# EAGLE design RemoteControl (EAGLE 9.5.0)
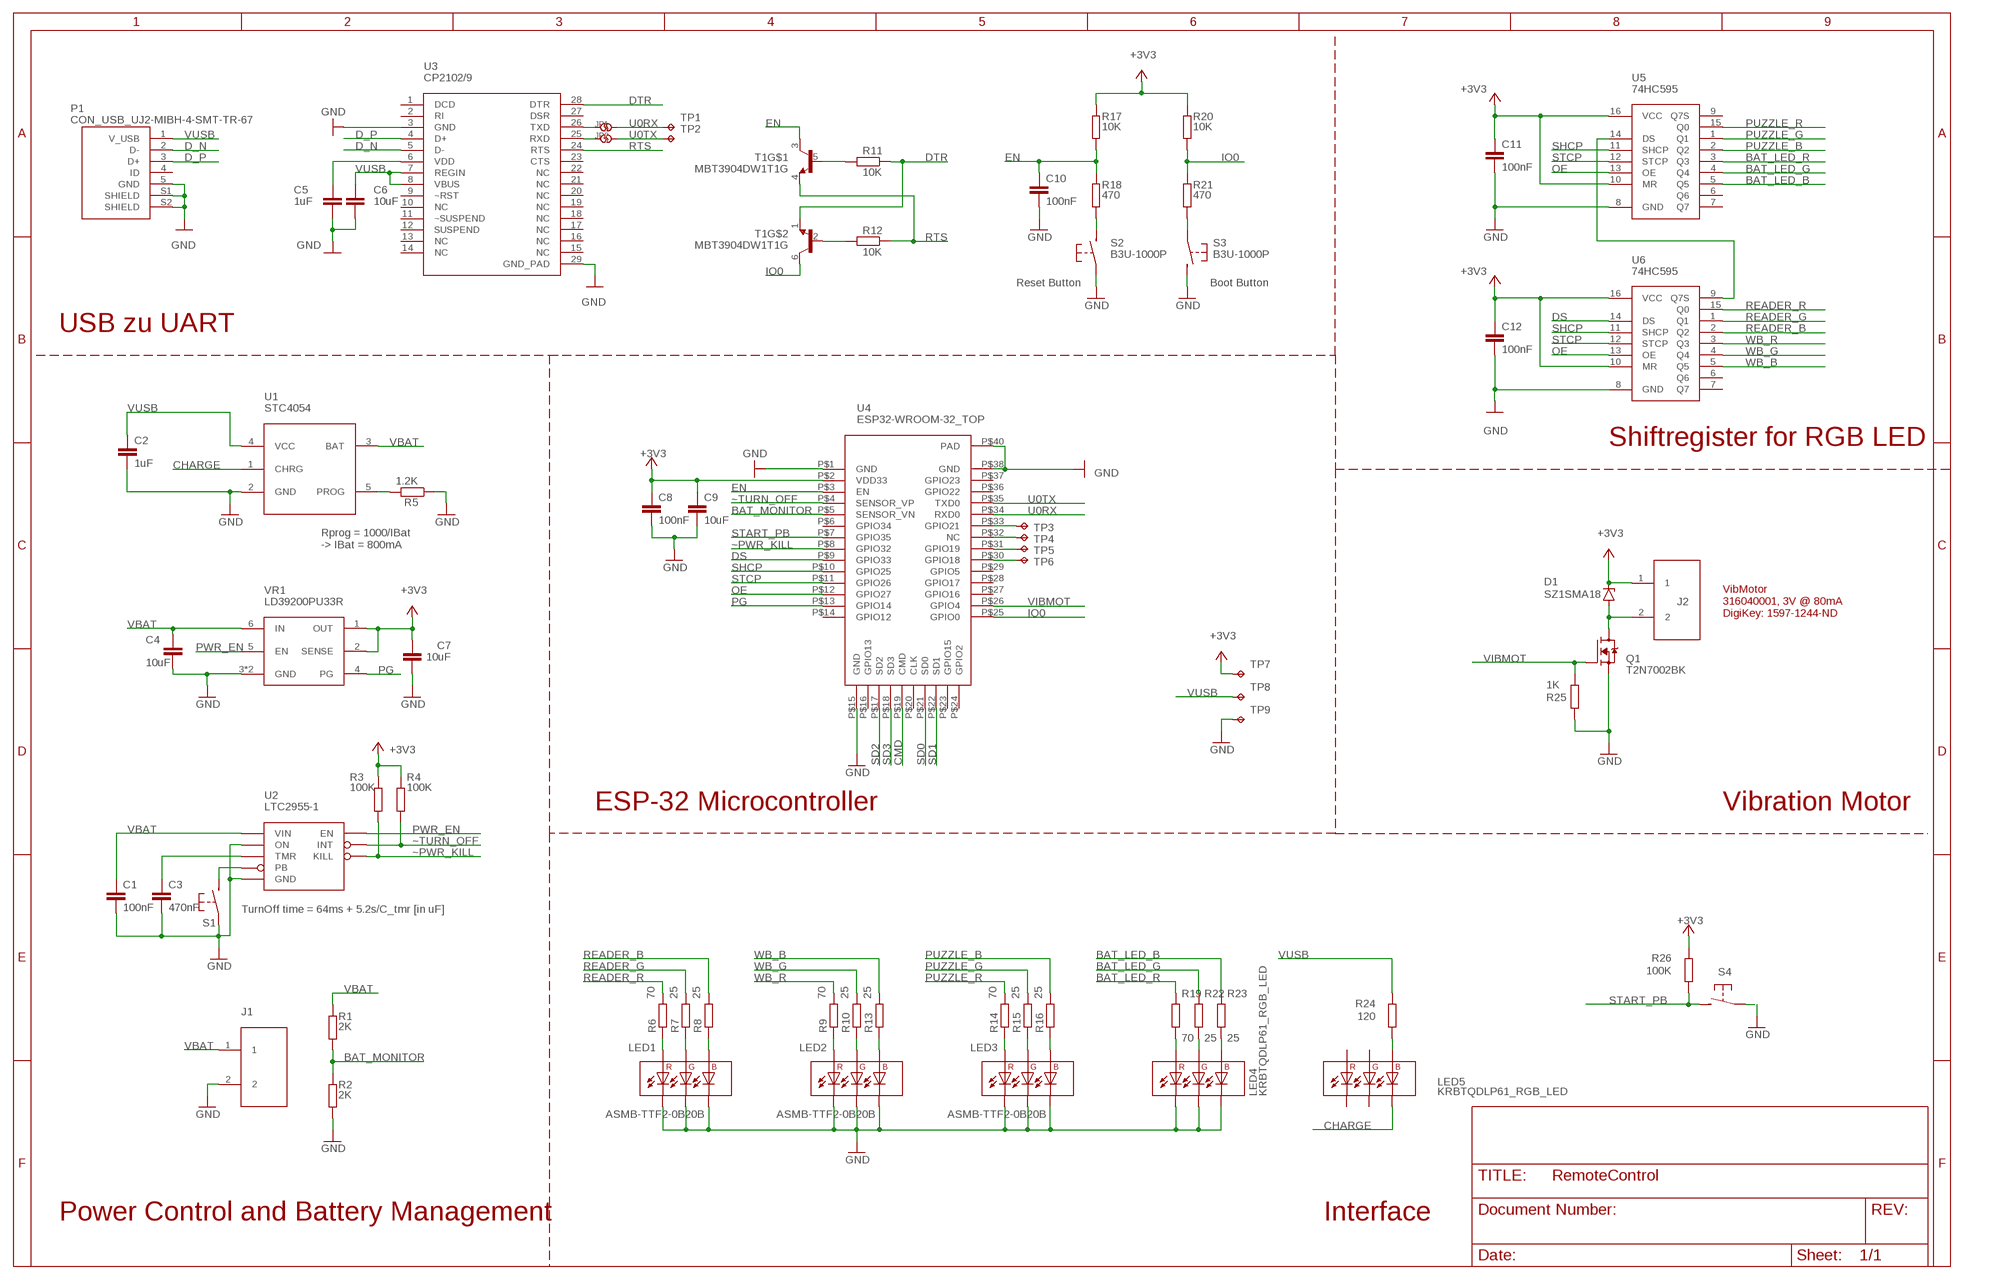
[diagram p0: schematic, sheet 1]

## Parts
C1  100nF  CAP_0603  [0603]
C2  1uF  CAP_0603  [0603]
C3  470nF  CAP_0603  [0603]
C4  10uF  CAP_0603  [0603]
C5  1uF  CAP_0603  [0603]
C6  10uF  CAP_0603  [0603]
C7  10uF  CAP_0603  [0603]
C8  100nF  CAP_0603  [0603]
C9  10uF  CAP_0603  [0603]
C10  100nF  CAP_0603  [0603]
C11  100nF  CAP_0603  [0603]
C12  100nF  CAP_0603  [0603]
D1  SZ1SMA18  SZ1SMA18AT3G_Z_DIODE  [SMA-2]
J1  CON_2  [CON_2]
J2  CON_2  [CON_2]
JP1  SOLDER_JUMPER  [SOLDER_JUMPER]
JP2  SOLDER_JUMPER  [SOLDER_JUMPER]
LED1  ASMB-TTF2-0B20B  ASMB-TTF2-0B20B_RGB_LED  [ASMB-TTF2-0B20B_RGB_LED]
LED2  ASMB-TTF2-0B20B  ASMB-TTF2-0B20B_RGB_LED  [ASMB-TTF2-0B20B_RGB_LED]
LED3  ASMB-TTF2-0B20B  ASMB-TTF2-0B20B_RGB_LED  [ASMB-TTF2-0B20B_RGB_LED]
LED4  KRBTQDLP61_RGB_LED  [KRBTQDLP61_RGB_LED]
LED5  KRBTQDLP61_RGB_LED  [KRBTQDLP61_RGB_LED]
P1  CON_USB_UJ2-MIBH-4-SMT-TR-67  [CON_USB_UJ2-MIBH-4-SMT-TR-67]
Q1  T2N7002BK  [SOT23-3]
R1  2K  RES_0603  [0603]
R2  2K  RES_0603  [0603]
R3  100K  RES_0603  [0603]
R4  100K  RES_0603  [0603]
R5  1.2K  RES_0603  [0603]
R6  70  RES_0603  [0603]
R7  25  RES_0603  [0603]
R8  25  RES_0603  [0603]
R9  70  RES_0603  [0603]
R10  25  RES_0603  [0603]
R11  10K  RES_0603  [0603]
R12  10K  RES_0603  [0603]
R13  25  RES_0603  [0603]
R14  70  RES_0603  [0603]
R15  25  RES_0603  [0603]
R16  25  RES_0603  [0603]
R17  10K  RES_0603  [0603]
R18  470  RES_0603  [0603]
R19  70  RES_0603  [0603]
R20  10K  RES_0603  [0603]
R21  470  RES_0603  [0603]
R22  25  RES_0603  [0603]
R23  25  RES_0603  [0603]
R24  120  RES_0603  [0603]
R25  1K  RES_0603  [0603]
R26  100K  RES_0603  [0603]
S1  EG5358CT-ND_PB  [EG5358CT-ND_PB]
S2  B3U-1000P  BUTTON_B3U-1000P  [B3U-1000P]
S3  B3U-1000P  BUTTON_B3U-1000P  [B3U-1000P]
S4  TL3313AF160QG_2  BUTTON_TL3313AF160QG_2  [TL3313AF160QG_2]
T1  MBT3904DW1T1G  [SOT23-6]
TP1  TP  [TEST_PAD]
TP2  TP  [TEST_PAD]
TP3  TP  [TEST_PAD]
TP4  TP  [TEST_PAD]
TP5  TP  [TEST_PAD]
TP6  TP  [TEST_PAD]
TP7  TP  [TEST_PAD]
TP8  TP  [TEST_PAD]
TP9  TP  [TEST_PAD]
U1  STC4054  STC4054_BAT_CHARGER  [TSOT23-5L]
U2  LTC2955-1  LTC2955-1_ON/OFF_CTLR  [SOT23-8]
U3  CP2102/9  [QFN-28]
U4  ESP32-WROOM-32_TOP  [ESP32-WROOM-32_TOP]
U5  74HC595  74HC595_SHIFTREGISTER  [SOIC-16]
U6  74HC595  74HC595_SHIFTREGISTER  [SOIC-16]
VR1  LD39200PU33R  LD39200PU33R_V-REG  [DFN-6]

## Nets
+3V3: C7.2 C8.1 C9.1 C11.1 C12.1 D1.1(C) J2.1 R3.1 R4.1 R17.2 R20.2 R26.2 TP7.TP U4.P$2(VDD33) U5.10(MR) U5.16(VCC) U6.10(MR) U6.16(VCC) VR1.1(OUT) VR1.2(SENSE)
BAT_LED_B: R23.2 U5.5(Q5)
BAT_LED_G: R22.2 U5.4(Q4)
BAT_LED_R: R19.2 U5.3(Q3)
BAT_MONITOR: R1.2 R2.1 U4.P$5(SENSOR_VN)
CHARGE: LED5.P$4(BC) U1.1(CHRG)
CMD: U4.P$19(CMD)
D_N: P1.2(D-) U3.5(D-)
D_P: P1.3(D+) U3.4(D+)
DS: U4.P$9(GPIO33) U6.14(DS)
DTR: R11.1 T1.1(E) U3.28(DTR)
EN: C10.1 R17.1 R18.2 T1.3(C) U4.P$3(EN)
GND: C1.2 C2.2 C3.2 C4.2 C5.2 C6.2 C7.1 C8.2 C9.2 C10.2 C11.2 C12.2 J1.2 LED1.BC LED1.GC LED1.RC LED2.BC LED2.GC LED2.RC LED3.BC LED3.GC LED3.RC LED4.P$3(GC) LED4.P$4(BC) LED4.P$6(RC) P1.5(GND) P1.S1(SHIELD) P1.S2(SHIELD) Q1.2(S) R2.2 R5.1 R25.1 S1.1(P) S1.S1(P) S1.S2(P) S2.P$1(P) S3.P$2(S) S4.1(P) S4.2(P) TP9.TP U1.2(GND) U2.1(ON) U2.4(GND) U3.3(GND) U3.29(GND_PAD) U4.P$1(GND) U4.P$15(GND) U4.P$38(GND) U4.P$40(PAD) U5.8(GND) U6.8(GND) VR1.3(GND) VR1.7(GND)
IO0: R20.1 R21.2 T1.6(C) U4.P$25(GPIO0)
N$2: U5.14(DS) U6.9(Q7S)
N$3: D1.2(A) J2.2 Q1.3(D)
N$6: R11.2 T1.5(B)
N$7: R12.2 T1.2(B)
N$8: C5.1 U3.6(VDD)
N$9: LED4.P$5(RA) R19.1
N$10: R18.1 S2.P$2(S)
N$11: R21.1 S3.P$1(P)
N$15: LED5.P$2(BA) R24.1
N$18: LED4.P$1(GA) R22.1
N$19: R5.2 U1.5(PROG)
N$20: JP1.P$1 U3.26(TXD)
N$21: LED4.P$2(BA) R23.1
N$22: JP2.P$1 U3.25(RXD)
N$23: S1.2(S) U2.5(PB)
N$24: TP5.TP U4.P$31(GPIO19)
N$25: C3.1 U2.3(TMR)
N$26: TP6.TP U4.P$30(GPIO18)
N$28: TP3.TP U4.P$33(GPIO21)
N$29: LED2.RA R9.1
N$30: TP4.TP U4.P$32(NC)
N$31: LED2.GA R10.1
N$32: LED2.BA R13.1
N$33: LED3.RA R14.1
N$34: LED3.GA R15.1
N$35: LED3.BA R16.1
N$36: LED1.RA R6.1
N$37: LED1.GA R7.1
N$38: LED1.BA R8.1
OE: U4.P$12(GPIO27) U5.13(OE) U6.13(OE)
PG: U4.P$13(GPIO14) VR1.4(PG)
PUZZLE_B: R16.2 U5.2(Q2)
PUZZLE_G: R15.2 U5.1(Q1)
PUZZLE_R: R14.2 U5.15(Q0)
PWR_EN: U2.7(EN) VR1.5(EN)
READER_B: R8.2 U6.2(Q2)
READER_G: R7.2 U6.1(Q1)
READER_R: R6.2 U6.15(Q0)
RTS: R12.1 T1.4(E) U3.24(RTS)
SD0: U4.P$21(SD0)
SD1: U4.P$22(SD1)
SD2: U4.P$17(SD2)
SD3: U4.P$18(SD3)
SHCP: U4.P$10(GPIO25) U5.11(SHCP) U6.11(SHCP)
START_PB: R26.1 S4.3(S) S4.4(S) U4.P$7(GPIO35)
STCP: U4.P$11(GPIO26) U5.12(STCP) U6.12(STCP)
U0RX: JP1.P$2 TP1.TP U4.P$34(RXD0)
U0TX: JP2.P$2 TP2.TP U4.P$35(TXD0)
VBAT: C1.1 C4.1 J1.1 R1.1 U1.3(BAT) U2.6(VIN) VR1.6(IN)
VIBMOT: Q1.1(G) R25.2 U4.P$26(GPIO4)
VUSB: C2.1 C6.1 P1.1(V_USB) R24.2 TP8.TP U1.4(VCC) U3.7(REGIN) U3.8(VBUS)
WB_B: R13.2 U6.5(Q5)
WB_G: R10.2 U6.4(Q4)
WB_R: R9.2 U6.3(Q3)
~PWR_KILL: R3.2 U2.2(KILL) U4.P$8(GPIO32)
~TURN_OFF: R4.2 U2.8(INT) U4.P$4(SENSOR_VP)
Unconnected: LED5.P$1(GA) LED5.P$3(GC) LED5.P$5(RA) LED5.P$6(RC) P1.4(ID) U3.1(DCD) U3.2(RI) U3.9(~RST) U3.10(NC) U3.11(~SUSPEND) U3.12(SUSPEND) U3.13(NC) U3.14(NC) U3.15(NC) U3.16(NC) U3.17(NC) U3.18(NC) U3.19(NC) U3.20(NC) U3.21(NC) U3.22(NC) U3.23(CTS) U3.27(DSR) U4.P$6(GPIO34) U4.P$14(GPIO12) U4.P$16(GPIO13) U4.P$20(CLK) U4.P$23(GPIO15) U4.P$24(GPIO2) U4.P$27(GPIO16) U4.P$28(GPIO17) U4.P$29(GPIO5) U4.P$36(GPIO22) U4.P$37(GPIO23) U5.6(Q6) U5.7(Q7) U5.9(Q7S) U6.6(Q6) U6.7(Q7)

## Notes on the sheet
- Reset Button | Boot Button
- USB zu UART
- Shiftregister for RGB LED
- Rprog = 1000/IBat 
  -> IBat = 800mA
- VibMotor
  316040001, 3V @ 80mA
  DigiKey: 1597-1244-ND
- ESP-32 Microcontroller | Vibration Motor
- TurnOff time = 64ms + 5.2s/C_tmr [in uF]
- Power Control and Battery Management | Interface

## Library data of the parts
C1-C12 = ZHAW_BA:CAP_0603: Cap, 0603, Keramik, X7R, +-10%
D1 = ZHAW_BA:SZ1SMA18AT3G_Z_DIODE: TVS DIODE 18V 29.2V SMA Distrelec: Pt.Nr: 170-06-435 https://www.distrelec.ch/de/zenerdiode-1w-18v-1ua-do-214ac-sma-diotec-z1sma18/p/17006435?track=true&no-cache=true&marketingPopup=false DigiKey: Pt.Nr: F11508CT-ND https://www.digikey.ch/product-detail/de/littelfuse-inc/SZ1SMA18AT3G/F11508CT-ND/9326836
J1 J2 = ZHAW_BA:CON_2: 2 Pin Solder Pad
JP1 JP2 = ZHAW_BA:SOLDER_JUMPER
LED1-LED3 = ZHAW_BA:ASMB-TTF2-0B20B_RGB_LED: RGB LED, ASMB-TTF2-0B20B, 2,1V Rot, 2,9V Grün, 2,9V Blau @ 20mA DigiKey: Pt.Nr: 516-3909-1-ND https://www.digikey.ch/product-detail/de/broadcom-limited/ASMB-TTF2-0B20B/516-3909-1-ND/7917028
LED4 LED5 = ZHAW_BA:KRBTQDLP61_RGB_LED: RGB LED, 2,1V Rot, 3,2V Grün, 2,9V Blau @ 20mA KRBT QDLP61.3A-5B5C-CF DigiKey: Pt.Nr: 475-3482-1-ND https://www.digikey.ch/product-detail/de/osram-opto-semiconductors-inc/KRBT-QDLP61-3A-5B5C-CF/475-3482-1-ND/7907970
P1 = ZHAW_BA:CON_USB_UJ2-MIBH-4-SMT-TR-67: Micro B USB Buchse, 90° PCB Mount UJ2-MIBH-4-SMT-TR-67 DigiKey: Pt.Nr: 102-4970-1-ND https://www.digikey.ch/product-detail/de/cui-devices/UJ2-MIBH-4-SMT-TR-67/102-4970-1-ND/9564435
Q1 = ZHAW_BA:T2N7002BK: MOSFET N-CH 60V 400MA SOT23-3 Distrelec: Pt.Nr: 300-32-496 https://www.distrelec.ch/de/mosfet-60-35-320-mw-sot-23-nxp-2n7002bk/p/30032496?track=true&no-cache=true&marketingPopup=false DigiKey: Pt.Nr: T2N7002BKLMCT-ND https://www.digikey.ch/product-detail/de/toshiba-semiconductor-and-storage/T2N7002BK-LM/T2N7002BKLMCT-ND/5409280
R1-R26 = ZHAW_BA:RES_0603: Resistor, 0603, 0.1 W, +-1%
S1 = ZHAW_BA:EG5358CT-ND_PB: Push Button, 90° PCB Mount, TL3360CF185Q DigiKey: Pt.Nr: EG5358CT-ND https://www.digikey.ch/product-detail/de/e-switch/TL3360CF185Q/EG5358CT-ND/5816203
S2 S3 = ZHAW_BA:BUTTON_B3U-1000P: SMD Button, 3 x 2.5 x 1.6 mm, 12V Distrelec: Pt.Nr: SW1020CT-ND https://www.digikey.ch/product-detail/de/omron-electronics-inc-emc-div/B3U-1000P/SW1020CT-ND/1534357 DigiKey: Pt.Nr: 135-59-010 https://www.distrelec.ch/de/subminiatur-tastschalter-b3u-schliesser-5n-5mm-omron-electronic-components-b3u-1000p/p/13559010?track=true&no-cache=true&marketingPopup=false
S4 = ZHAW_BA:BUTTON_TL3313AF160QG_2: Button 4.6 x 4.6 x 1.5 mm, TL3313AF160QG DigiKey: Pt.Nr:EG6064CT-ND https://www.digikey.ch/products/de/switches/tactile-switches/197?k=TL3313AF160QG&k=&pkeyword=TL3313AF160QG&sv=0&pv7=2&sf=0&quantity=&ColumnSort=0&page=1&pageSize=25
T1 = ZHAW_BA:MBT3904DW1T1G: Beschreibung Zweifacher NPN Transistor, 200mA, 40V DigiKey: Pt.Nr: MBT3904DW1T1GOSCT-ND https://www.digikey.ch/product-detail/de/on-semiconductor/MBT3904DW1T1G/MBT3904DW1T1GOSCT-ND/918012
TP1-TP9 = ZHAW_BA:TP
U1 = ZHAW_BA:STC4054_BAT_CHARGER: STC4054GR IC BATT CHG LI-ION 1CEL TSOT23-5, 800mA DigiKey: Pt.Nr: 497-5809-1-ND https://www.digikey.ch/product-detail/de/stmicroelectronics/STC4054GR/497-5809-1-ND/1506465
U2 = ZHAW_BA:LTC2955-1_ON/OFF_CTLR: On/OFF Controller, PUSHBUTT TSOT23-8 DigiKey: Pt.Nr: LTC2955CTS8-1#TRMPBFCT-ND https://www.digikey.ch/products/de?keywords=LTC2955CTS8-1%23TRMPBFCT-ND
U3 = ZHAW_BA:CP2102/9: Schnittstellen - Controller, USB-TO-UART BRIDGE 28VQFN DigiKey: Pt.Nr: 336-1160-1-ND https://www.digikey.ch/products/de/integrated-circuits-ics/interface-controllers/753?k=CP2102&k=&pkeyword=CP2102&sv=0&pv7=2&sf=0&FV=-8%7C753&quantity=&ColumnSort=0&page=1&stock=1&pageSize=25
U4 = ZHAW_BA:ESP32-WROOM-32_TOP: ESP32 Mikrokontroller Distrelec: Pt.Nr: 301-29-219 https://www.distrelec.ch/de/esp32-wlan-bt-ble-mcu-modul-adafruit-3320/p/30129219?track=true&no-cache=true&marketingPopup=false DigiKey: Pt.Nr: 1528-1801-ND https://www.digikey.ch/product-detail/de/adafruit-industries-llc/3320/1528-1801-ND/6560941
U5 U6 = ZHAW_BA:74HC595_SHIFTREGISTER: Shiftregister 74HC595D-Q100,118, 8Bit DigiKey: Pt.Nr: 1727-1011-1-ND https://www.digikey.ch/product-detail/de/nexperia-usa-inc/74HC595D-Q100-118/1727-1011-1-ND/3749018
VR1 = ZHAW_BA:LD39200PU33R_V-REG: Spannungsregler, LD39200PU33R, 3.3V, 2A, 0.15mV DigiKey: Pt.Nr: 497-15229-1-ND https://www.digikey.ch/product-detail/de/stmicroelectronics/LD39200PU33R/497-15229-1-ND/5131765

## Board
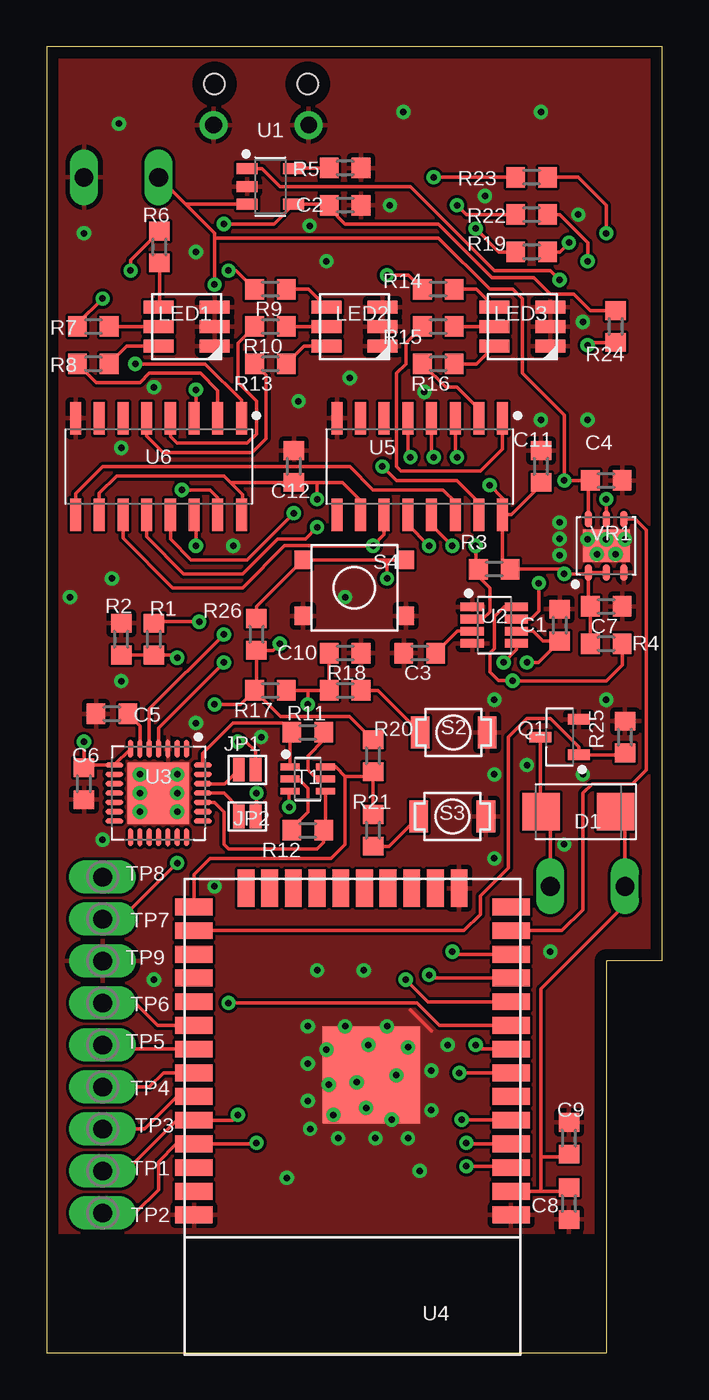
[diagram p1: board, top side]
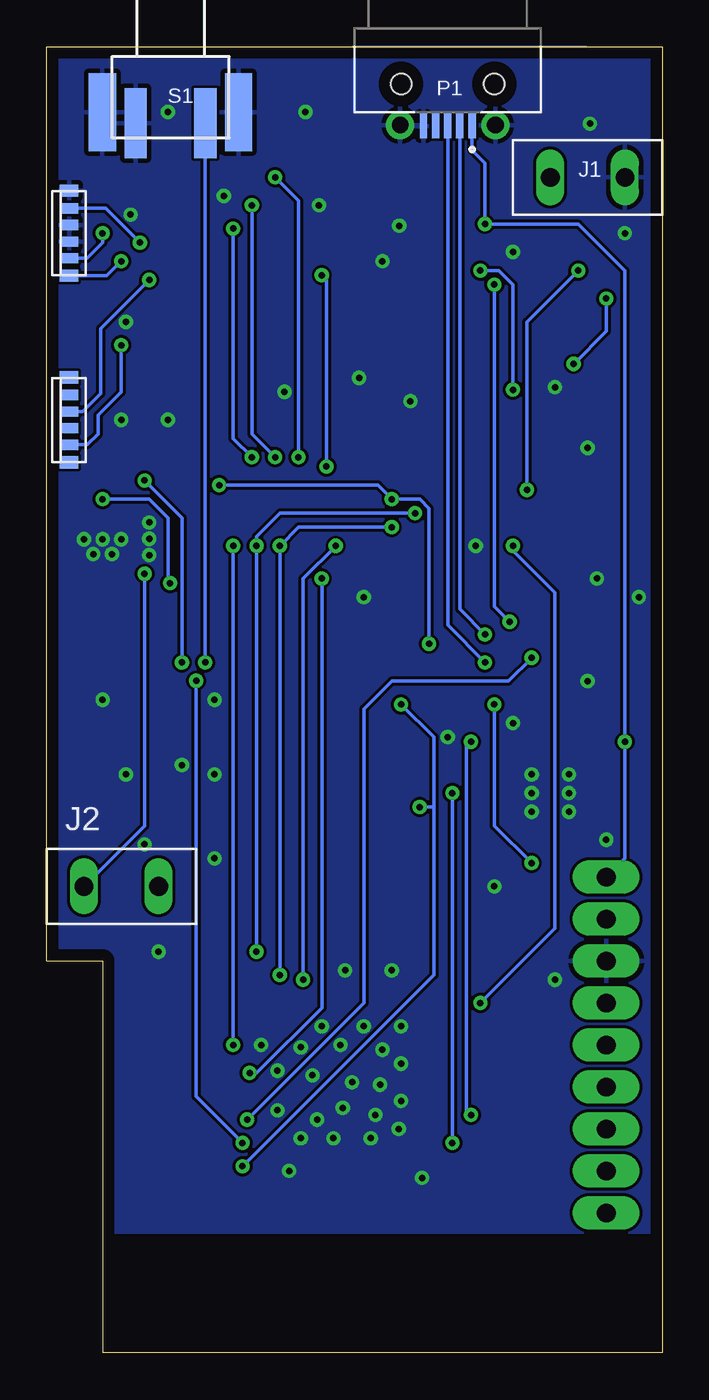
[diagram p2: board, bottom side, seen from below]

Size 33 x 70 mm. Coordinates in mm from the lower left corner, seen from the top.
Outline: 0,0 30,0 30,21 33,21 33,70 0,70 0,0
Copper layers (1*16): Top 0.035mm / dielectric 1.5mm / Bottom 0.035mm
Design rules "default *": minimum track width 6mil, minimum drill 0.35mm, track to track 6mil, track to pad 6mil, pad to pad 5mil, via to via 6mil, smd to smd 5mil, copper to edge 25mil, drill to drill 6mil, minimum pad ring 10mil, minimum via ring 8mil, stop-mask expansion 4mil, vias tented up to drill 14mil, thermal gap 10mil
bKeepout: area 0,6.3 to 25,60

### Footprints (pad centres in the part's own frame; a part is rotated, then mirrored left to right if it is on the bottom)
0603 = smd 1 x 1.1: 1 -0.85,0; 2 0.85,0
SMA-2 = smd 2 x 2: 1 -2,0; 2 2,0
CON_2 = drill 1 long: 1 -2,0; 2 2,0
SOLDER_JUMPER = smd 0.635 x 1.27: P$1 -0.45,0; P$2 0.45,0
ASMB-TTF2-0B20B_RGB_LED = smd 1.6 x 0.7: BA -1.5,-1.05; BC 1.5,-1.05; GA -1.5,0; GC 1.5,0; RA -1.5,1.05; RC 1.5,1.05
KRBTQDLP61_RGB_LED = smd 0.65 x 1: P$1 -2.275,0; P$6 2.275,0 | smd 0.55 x 1: P$2 -1.335,0; P$3 -0.445,0; P$4 0.445,0; P$5 1.335,0
CON_USB_UJ2-MIBH-4-SMT-TR-67 = smd 1.3 x 0.4: 1 4.25,1.3; 2 4.25,0.65; 3 4.25,0; 4 4.25,-0.65; 5 4.25,-1.3 | drill 0.9 pad 1.5: S1 4.2,2.55; S2 4.2,-2.55 | hole 1.1: 2,2.5; 2,-2.5
SOT23-3 = smd 1.18 x 0.56: 1 -1.024,0.95; 2 -1.024,-0.95; 3 1.024,0
EG5358CT-ND_PB = smd 1.2 x 3.76: 1 -1.87,-3.58; 2 1.87,-3.58 | smd 1.46 x 4.19: S1 -3.65,-3; S2 3.65,-3
B3U-1000P = smd 1 x 1.7: P$1 -1.8,0; P$2 1.8,0
TL3313AF160QG_2 = smd 0.9 x 1: 1 -2.75,-1.5; 2 2.75,-1.5; 3 -2.75,1.5; 4 2.75,1.5
SOT23-6 = smd 1.02 x 0.36: 1 -0.955,0.65; 2 -0.955,0; 3 -0.955,-0.65; 4 0.955,-0.65; 5 0.955,0; 6 0.955,0.65
TEST_PAD = drill 1 pad 1.8 long: TP 0,0
TSOT23-5L = smd 1.119 x 0.589: 1 -1.246,0.95; 2 -1.246,0; 3 -1.246,-0.95; 4 1.246,-0.95; 5 1.246,0.95
SOT23-8 = smd 1.237 x 0.459: 1 -1.187,0.975; 2 -1.187,0.325; 3 -1.187,-0.325; 4 -1.187,-0.975; 5 1.187,-0.975; 6 1.187,-0.325; 7 1.187,0.325; 8 1.187,0.975
QFN-28 = smd 0.969 x 0.264: 1 -2.371,1.5; 2 -2.371,1; 3 -2.371,0.5; 4 -2.371,0; 5 -2.371,-0.5; 6 -2.371,-1; 7 -2.371,-1.5; 15 2.371,-1.5; 16 2.371,-1; 17 2.371,-0.5; 18 2.371,0; 19 2.371,0.5; 20 2.371,1; 21 2.371,1.5 | smd 0.264 x 0.969: 8 -1.5,-2.371; 9 -1,-2.371; 10 -0.5,-2.371; 11 0,-2.371; 12 0.5,-2.371; 13 1,-2.371; 14 1.5,-2.371; 22 1.5,2.371; 23 1,2.371; 24 0.5,2.371; 25 0,2.371; 26 -0.5,2.371; 27 -1,2.371; 28 -1.5,2.371 | smd 3.3 x 3.3: 29 0,0
ESP32-WROOM-32_TOP = smd 2 x 0.9: P$1 0.5,18.01; P$2 0.5,16.74; P$3 0.5,15.47; P$4 0.5,14.2; P$5 0.5,12.93; P$6 0.5,11.66; P$7 0.5,10.39; P$8 0.5,9.12; P$9 0.5,7.85; P$10 0.5,6.58; P$11 0.5,5.31; P$12 0.5,4.04; P$13 0.5,2.77; P$14 0.5,1.5; P$25 17.5,1.5; P$26 17.5,2.77; P$27 17.5,4.04; P$28 17.5,5.31; P$29 17.5,6.58; P$30 17.5,7.85; P$31 17.5,9.12; P$32 17.5,10.39; P$33 17.5,11.66; P$34 17.5,12.93; P$35 17.5,14.2; P$36 17.5,15.47; P$37 17.5,16.74; P$38 17.5,18.01 | smd 0.9 x 2: P$15 3.285,0.5; P$16 4.555,0.5; P$17 5.825,0.5; P$18 7.095,0.5; P$19 8.365,0.5; P$20 9.635,0.5; P$21 10.905,0.5; P$22 12.175,0.5; P$23 13.445,0.5; P$24 14.715,0.5 | smd 5.2 x 5.2: P$40 8,10.51
SOIC-16 = smd 1.746 x 0.592: 1 -2.585,4.445; 2 -2.585,3.175; 3 -2.585,1.905; 4 -2.585,0.635; 5 -2.585,-0.635; 6 -2.585,-1.905; 7 -2.585,-3.175; 8 -2.585,-4.445; 9 2.585,-4.445; 10 2.585,-3.175; 11 2.585,-1.905; 12 2.585,-0.635; 13 2.585,0.635; 14 2.585,1.905; 15 2.585,3.175; 16 2.585,4.445
DFN-6 = smd 0.86 x 0.397: 1 -1.435,0.95; 2 -1.435,0; 3 -1.435,-0.95; 4 1.435,-0.95; 5 1.435,0; 6 1.435,0.95 | smd 1.75 x 2.5: 7 0,0

### Placement (x,y rotation side)
C1  27.5,39 90 top
C2  16,61.5 0 top
C3  20,37.5 180 top
C4  30,46.75 0 top
C5  3.5,34.25 180 top
C6  2,30.5 270 top
C7  30,40 180 top
C8  28,8 270 top
C9  28,11.5 90 top
C10  16,37.5 0 top
C11  26.5,47.5 90 top
C12  13.25,47.5 90 top
D1  28.5,29 180 top
J1  4,63 0 bottom
J2  29,25 0 bottom
JP1  10.75,31.25 0 top
JP2  10.75,28.75 0 top
LED1  7.5,55 0 top
LED2  16.5,55 0 top
LED3  25.5,55 0 top
LED4  31.8,60 90 bottom
LED5  31.8,50 90 bottom
P1  11.5,70 270 bottom
Q1  27.5,33 180 top
R1  5.75,38.25 270 top
R2  4,38.25 90 top
R3  24,42 180 top
R4  30,38 0 top
R5  16,63.5 180 top
R6  6.05,59.26 90 top
R7  2.5,55 180 top
R8  2.5,53 180 top
R9  12,57 180 top
R10  12,55 180 top
R11  14,33.25 0 top
R12  14,28 180 top
R13  12,53 180 top
R14  21,57 180 top
R15  21,55 180 top
R16  21,53 180 top
R17  12,35.5 180 top
R18  16,35.5 180 top
R19  26,59 180 top
R20  17.5,32 90 top
R21  17.5,28 90 top
R22  26,61 180 top
R23  26,63 180 top
R24  30.5,55 90 top
R25  31,33 270 top
R26  11.25,38.5 270 top
S1  26.36,69.48 0 bottom
S2  21.82,33.25 180 top
S3  21.75,28.75 0 top
S4  16.5,41 0 top
T1  14,30.75 0 top
TP1  3,9.75 90 top
TP2  3,7.5 270 top
TP3  3,12 90 top
TP4  3,14.25 90 top
TP5  3,16.5 90 top
TP6  3,18.75 90 top
TP7  3,23.25 90 top
TP8  3,25.5 90 top
TP9  3,21 90 top
U1  12,62.5 0 top
U2  24,39 0 top
U3  6,30 270 top
U4  25.4,25.4 180 top
U5  20,47.5 270 top
U6  6,47.5 270 top
VR1  30,43.25 90 top

### Tracks (layer width: path | path; a pad name or v marks a point on that pad's centre or on a via)
+3V3  (via drill 0.35)
  Top 0.2: VR1.1 VR1.2 | C11.1 26.57,46.58 24.91,44.91 U5.16 | VR1.1 29.05,39.85 C7.2 R4.1 | U5.16 24.45,42.41 R3.1 27.5,42 v27.75,41.75 28.98,41.75 VR1.1 | U5.10 16.82,45.67 15.85,46.65 14.5,46.65 | 14.5,46.65 C12.1 9.85,46.65 | U6.10 2.83,46.08 3.75,47 9.5,47 9.85,46.65 | 9.85,46.65 10.5,46 10.5,44.97 U6.16 | R17.2 11.25,35.6 R26.2 12.15,37.65 v12.5,38 | U4.P$2 26.5,8.66 | 26.5,8.66 27.81,8.66 C8.1 | D1.1 31,28.5 J2.1 31,24 26.5,19.5 26.5,10.5 | 26.5,10.5 26.5,8.66 | U5.16 24.45,45.8 v23.75,46.5 | 14.5,46.65 v14.5,45.75 | R20.2 16.25,34.1 12.55,34.1 R17.2 | C9.1 27.85,10.5 26.5,10.5 | TP7.TP 4,23.25 v7,26.25 | v9,34.75 10.4,34.75 R17.2
  Bottom 0.2: v23.75,46.5 15.25,46.5 v14.5,45.75 13,45.75 12.5,45.25 v12.5,38 | v7,26.25 9,28.25 v9,34.75 | v27.75,41.75 27.75,28.25 J2.1
BAT_LED_B  (via drill 0.35)
  Top 0.2: R23.2 v20.75,63 | v19.5,48 19.36,48.13 U5.5
  Bottom 0.2: v20.75,63 19.5,61.75 v19.5,48
BAT_LED_G  (via drill 0.35)
  Top 0.2: R22.2 22.5,61 v22,61.5 | v20.75,48 20.64,48.12 U5.4
  Bottom 0.2: v22,61.5 22,49.25 v20.75,48
BAT_LED_R  (via drill 0.35)
  Top 0.2: R19.2 24.25,59 v23,60.25 | v22,48 21.91,48.09 U5.3
  Bottom 0.2: v23,60.25 23,49 v22,48
BAT_MONITOR  (via drill 0.35)
  Top 0.2: U4.P$5 24.87,12.5 v22.25,12.5 | v7,37.25 6.85,37.4 R1.2 R2.1
  Bottom 0.2: v22.25,12.5 16,18.75 16,34.5 14.5,36 8.25,36 v7,37.25
CHARGE  (via drill 0.35)
  Top 0.2: v27.5,57.5 27,58 24,58 19.5,62.5 12.5,62.5 11.55,63.45 U1.1
  Bottom 0.2: v27.5,57.5 30.1,54.9 30.1,52 30.1,51.9 30.1,51.4 31.05,50.45 LED5.P$4
D_N  (via drill 0.35)
  Top 0.2: U3.5 5.5,34.5 v9.5,38.5
  Bottom 0.2: P1.2 10.85,39.85 v9.5,38.5
D_P  (via drill 0.35)
  Top 0.2: v9.5,37 6,33.5 U3.4
  Bottom 0.2: P1.3 11.5,39 v9.5,37
DS  (via drill 0.35)
  Top 0.2: U4.P$9 21.06,17.55 19.86,18.75 v9.75,18.75 | v8,43.25 8,44.82 U6.14
  Bottom 0.2: v9.75,18.75 5.75,22.75 5.75,40.75 8,43 v8,43.25
DTR
  Top 0.2: U3.28 8.37,32.12 10,33.75 12.65,33.75 R11.1 13.04,33.15 T1.1
EN  (via drill 0.35)
  Top 0.2: C10.1 R18.2 14,35.5 | 14,35.5 R17.1 | U4.P$3 24.83,10 v22.5,10 | T1.3 13,30.05 v13,29.25 | 14,35.5 v14,34.75
  Bottom 0.2: v14,34.75 12.25,33 12.25,29.25 | 12.25,29.25 12.25,20.25 v22.5,10 | v13,29.25 12.25,29.25
GND  (via drill 0.35)
  Top 0.2: 19.5,18.38 20.62,17.25
  other vias: 4,48.5 13.5,51 3.5,41.5 29,50 26.5,50 28.5,61 26.5,66.5 19.12,66.5 3.88,65.88 2,60 15,58.5 8,59 23.5,62 30,35 24,35 24,26.5 12.88,9.38 21.5,16.5 20,9.75 24,31 16,40.5 27.5,43.62 9,25 14.5,20.5 17,20.5 18.5,12.5 14,17.5 15,16.25 14,15.5 16.62,14.5 14,13.5 15.12,14.38 14.12,12 15.62,11.5 15.38,12.75 17.62,11.5 17.12,13.12 19.38,11.5 27.5,44.5 29,43.6 30,43.6 31,43.6 29.5,42.8 30.5,42.8 18.4,61.5 14.1,60.4 27,21.5 27.75,27.25 25.75,31.5 28.75,31 10,43.25 20.25,51.5 28.75,55.25 5.75,20 27.5,42.75 20.62,13 18.75,14.88 17.25,16.5 16,17.5 18.25,17.5 19.38,16.38 20.62,15.12 5,31 5,30 5,29 7,31 7,30 7,29 3,27.5 4,36 8,33.75 11.5,33 16.25,52.25 5.75,51.75 1.25,40.5
  pour Top: -10,75 -10,-10 40,-10 40,75
  pour Bottom: -5,75 -5,-10 45,-10 45,75
IO0
  Top 0.2: R21.2 R20.1 17.25,30.9 16,30.9 | 16,30.9 16,27.25 15.25,26.5 8.75,26.5 7.9,25.65 U4.P$25 | 16,30.9 15.5,31.4 T1.6
N$2
  Top 0.2: U6.9 1.55,46.05 3,47.5 16.25,47.5 17.5,46.25 21.25,46.25 21.91,45.59 U5.14
N$3
  Top 0.2: Q1.3 26.48,29.02 D1.2 27,28.5 J2.2
N$6
  Top 0.2: R11.2 14.85,32.85 14,32 14,31.25 14.5,30.75 T1.5
N$7
  Top 0.2: R12.2 13.15,28.15 14,29 14,30.25 13.5,30.75 T1.2
N$8
  Top 0.2: C5.1 4.42,34.17 4.75,33.85 5,33.6 U3.6
N$9  (via drill 0.35)
  Top 0.2: R19.1 27.5,59 v28,59.5
  Bottom 0.2: LED4.P$5 29.84,61.34 v28,59.5
N$10
  Top 0.2: R18.1 17.77,35.5 S2.P$2
N$11
  Top 0.2: S3.P$1 18.35,27.15 R21.1
N$15  (via drill 0.35)
  Top 0.2: v29,54 29.15,54.15 R24.1
  Bottom 0.2: v29,54 29,51.5 30.25,50.25 30.25,49.25 30.84,48.66 LED5.P$2
N$18  (via drill 0.35)
  Top 0.2: R22.1 27.5,61 29,59.5 v29,58.5
  Bottom 0.2: LED4.P$1 29.77,57.73 v29,58.5
N$19
  Top 0.2: U1.5 13.3,63.5 R5.2
N$20
  Top 0.2: JP1.P$1 9.55,30.5 U3.26
N$21  (via drill 0.35)
  Top 0.2: R23.1 28.5,63 30,61.5 v30,60
  Bottom 0.2: v30,60 30,59.5 30.84,58.66 LED4.P$2
N$22
  Top 0.2: JP2.P$1 10.3,29.2 9.5,30 U3.25
N$23  (via drill 0.35)
  Top 0.2: v24.5,37 25.19,37.69 U2.5
  Bottom 0.2: S1.2 v24.5,37
N$24
  Top 0.2: U4.P$31 3.22,16.28 TP5.TP
N$25
  Top 0.2: C3.1 22.02,38.67 U2.3
N$26
  Top 0.2: U4.P$30 5.95,17.55 4.75,18.75 TP6.TP
N$28
  Top 0.2: U4.P$33 7,13.75 5.25,12 TP3.TP
N$29
  Top 0.2: R9.1 14.05,57 LED2.RA
N$30
  Top 0.2: TP4.TP 5.5,14.25 6.26,15.01 U4.P$32
N$31
  Top 0.2: R10.1 LED2.GA
N$32
  Top 0.2: R13.1 13.8,53.95 LED2.BA
N$33
  Top 0.2: R14.1 23.05,57 LED3.RA
N$34
  Top 0.2: R15.1 LED3.GA
N$35
  Top 0.2: R16.1 23.05,53 LED3.BA
N$36
  Top 0.2: R6.1 6.05,56.1 LED1.RA
N$37
  Top 0.2: R7.1 LED1.GA
N$38
  Top 0.2: R8.1 4.3,53.95 LED1.BA
OE  (via drill 0.35)
  Top 0.2: U6.13 6.63,43.62 7.75,42.5 10.75,42.5 v13.25,45 | v21.75,43.25 20.64,44.37 U5.13 | v21.75,21.5 21.89,21.36 U4.P$12
  Bottom 0.2: v13.25,45 20.5,45 21.75,43.75 v21.75,43.25 v21.75,21.5
PG
  Top 0.2: VR1.4 31.55,44.69 32.13,44.1 32.13,31.25 31.38,30.5 29.25,30.5 28.75,30 28.75,23.75 27.63,22.63 U4.P$13
PUZZLE_B
  Top 0.2: R16.2 21.4,51.75 22,51.75 23.18,50.58 U5.2
PUZZLE_G
  Top 0.2: R15.2 19.25,54.1 19.25,53 18.75,52.5 18.75,47.5 19,47.25 23.25,47.25 24.45,48.45 U5.1
PUZZLE_R  (via drill 0.35)
  Top 0.2: R14.2 19.4,57.75 v18.25,57.75 | v18,47.5 18.75,46.75 22,46.75 23.18,45.58 U5.15
  Bottom 0.2: v18.25,57.75 18,57.5 v18,47.5
PWR_EN  (via drill 0.35)
  Top 0.2: VR1.5 v30,45.75 | v26.38,41.25 26.38,39.75 25.96,39.33 U2.7
  Bottom 0.2: v30,45.75 27.5,45.75 26.5,44.75 26.5,41.37 v26.38,41.25
READER_B
  Top 0.2: R8.2 2.65,52 5,52 5.5,52.5 8.25,52.5 9.18,51.58 U6.2
READER_G  (via drill 0.35)
  Top 0.2: R7.2 1.65,55.15 v3,56.5 | v4.75,53 8.5,53 10.45,51.05 U6.1
  Bottom 0.2: v3,56.5 3,54.75 v4.75,53
READER_R  (via drill 0.35)
  Top 0.2: R6.2 4.5,58.56 v4.5,58 | v7.25,46.25 8.75,46.25 9.18,45.83 U6.15
  Bottom 0.2: v4.5,58 7.25,55.25 v7.25,46.25
RTS
  Top 0.2: T1.4 14.96,28.11 R12.1 14.85,27.35 14.5,27 9.75,27 9.5,27.25 9.5,29 9,29.5 U3.24
SHCP  (via drill 0.35)
  Top 0.2: U6.11 4.09,43.66 6.75,41 10.5,41 12.75,43.25 14.3,43.25 14.31,43.25 v17.5,43.25 18.09,43.84 U5.11 | v19.25,20 20.43,18.82 U4.P$10
  Bottom 0.2: v17.5,43.25 19.25,41.5 v19.25,20
START_PB  (via drill 0.35)
  Top 0.2: R26.1 11.25,40 S4.3 18.25,42.5 | S4.4 18.25,42.5 | 18.25,42.5 v18.25,41.5 | v22.12,15 U4.P$7
  Bottom 0.2: v18.25,41.5 18.25,18.5 21.75,15 v22.12,15
STCP  (via drill 0.35)
  Top 0.2: U6.12 5.37,43.74 7.36,41.75 10.5,41.75 12.38,43.62 13.88,43.62 v14.5,44.25 | v20.5,43.25 19.36,44.38 U5.12 | v20.5,20.25 20.66,20.09 U4.P$11
  Bottom 0.2: v14.5,44.25 19.5,44.25 v20.5,43.25 v20.5,20.25
U0RX  (via drill 0.35)
  Top 0.2: v10.25,12.75 9.97,12.47 U4.P$34 6.97,12.47 4.25,9.75 TP1.TP | JP1.P$2 11.2,32.25 10.7,32.75 v10.25,32.75
  Bottom 0.2: v10.25,12.75 10.5,13 10.5,32.5 v10.25,32.75
U0TX  (via drill 0.35)
  Top 0.2: v11.25,11.25 11.2,11.2 U4.P$35 6.95,11.2 6,10.25 6,8.75 4.75,7.5 TP2.TP | v11.25,30 11.25,28.8 JP2.P$2
  Bottom 0.2: v11.25,30 v11.25,11.25
VBAT  (via drill 0.35)
  Top 0.2: U1.3 7.45,61.55 | 7.45,61.55 J1.1 | 7.45,61.55 9,60 9,59.75 | VR1.6 29.05,46.65 C4.1 v27.75,46.75 27.75,50.25 25.5,52.5 25.5,56.5 25,57 23.75,57 21,59.75 9,59.75 | U2.6 26.07,38.67 26.6,38.15 C1.1 26.35,37 v25.75,37 | 9,59.75 v9,57.25 | R1.1 5.83,39.18 v8.18,39.18
  Bottom 0.2: v25.75,37 25.75,44.75 v27.75,46.75 | v9,57.25 9,40 v8.18,39.18
VIBMOT
  Top 0.2: R25.2 30.9,32.05 Q1.1 28.52,32.48 27,34 25.75,34 24.75,33 24.75,26 23.25,24.5 23.25,23.5 22.38,22.63 U4.P$26
VUSB  (via drill 0.35)
  Top 0.2: 15.1,61.55 U1.4 12.2,60.5 v9.5,60.5 | 15.1,61.55 C2.1 | R24.2 29.15,55.85 28.25,56.75 27,56.75 26.12,57.62 23.88,57.62 21,60.5 16,60.5 15.1,61.4 15.1,61.55 | U3.7 U3.8 2.15,31.5 C6.1 v2,32.75
  Bottom 0.2: P1.1 10.2,64.45 9.5,63.75 v9.5,60.5 4.5,60.5 2,58 v2,32.75 2,26.5 TP8.TP
WB_B
  Top 0.2: U6.5 5.37,49.13 6,48.5 6.25,48.25 11,48.25 11.75,49 11.75,52.4 R13.2
WB_G
  Top 0.2: R10.2 10.25,54.1 10.25,52 11.25,51 11.25,49.25 10.75,48.75 7,48.75 6.63,49.12 U6.4
WB_R  (via drill 0.35)
  Top 0.2: R9.2 10.15,58 v9.75,58 | v8,51.62 8,50.18 U6.3
  Bottom 0.2: v9.75,58 8.75,58 8,57.25 v8,51.62
~PWR_KILL  (via drill 0.35)
  Top 0.2: U2.2 23.37,39.33 23.75,39.71 23.75,41 23.15,41.6 R3.2 23,42.15 v23,43.25 | U4.P$8 23.22,16.28 v23,16.5
  Bottom 0.2: v23,16.5 v23,43.25
~TURN_OFF  (via drill 0.35)
  Top 0.2: U4.P$4 22.55,11.2 v22.5,11.25 | U2.8 24.52,39.98 24,39.46 24,37.75 23.75,37.5 23.75,36.5 24.23,36.02 v24.98,36.02 25,36 30,36 30.85,36.85 R4.2
  Bottom 0.2: v24.98,36.02 25,36 25,13.75 v22.5,11.25

### Text on the board
tStop: TOP
bStop: BOT | RemoteControl v1